# Altium schematic sheet AIL_Schem.SchDoc
size A
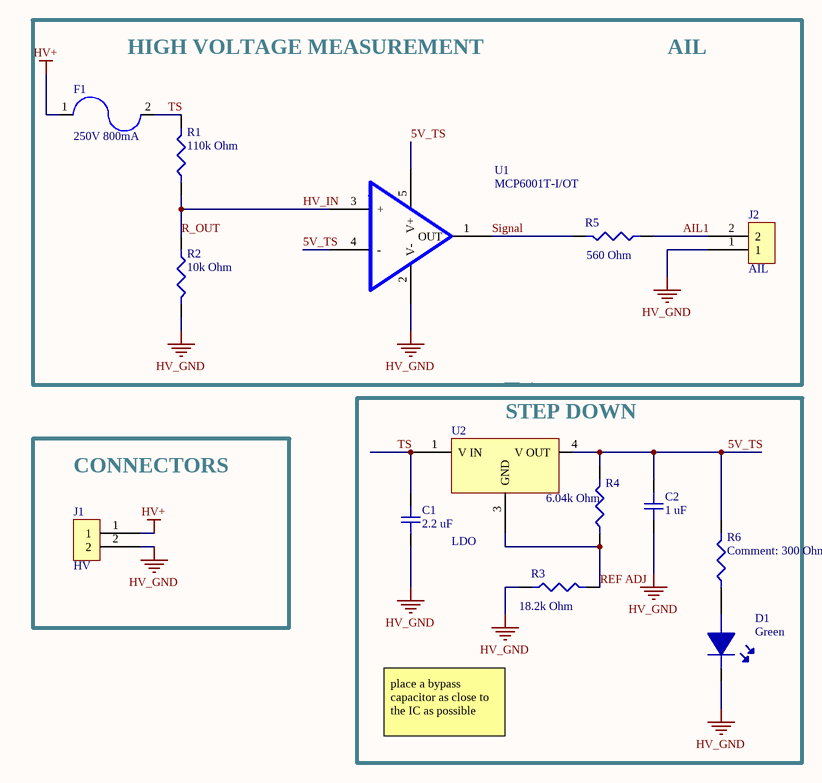
[diagram p0: AIL_Schem.SchDoc]

## Parts
C1  2.2 uF  [CAPC5850X25N]
C2  1 uF  [CAPC2012X14N]
D1  Green  [LED_0603]
F1  250V 800mA  [FUSE_SMD]
J1  HV  [2_PIN_CONNECTOR]
J2  AIL  [2_PIN_CONNECTOR]
R1  110k Ohm  [RESC3116X06N]
R2  10k Ohm  [RESC2012X06N]
R3  18.2k Ohm  [RESC2012X06N]
R4  6.04k Ohm  [RESC2012X06N]
R5  560 Ohm  [RESC2012X06N]
R6  300 Ohm  [RESC1608X06N]
U1  MCP6001T-I/OT
U2  LDO  [DPAK228P998X235-3N]

## Blocks framed on the sheet
STEP DOWN: C1 C2 D1 R3 R4 R6 U2
CONNECTORS: J1

## Nets
HV+: F1.1 J1.1
HV_GND: C1.1 C2.1 D1.2 J1.2 J2.1 R2.2 R3.1 U1.2(V-)
5V_TS: C2.2 R4.2 R6.2 U1.4(-) U1.5(V+) U2.4(V_OUT)
AIL1: J2.2 R5.1
HV_IN: R1.1 R2.1 U1.3(+)  [also labelled R_OUT]
REF ADJ: R3.2 R4.1 U2.3(GND)
Signal: R5.2 U1.1(OUT)
TS: C1.2 F1.2 R1.2 U2.1(V_IN)
NetD1_1: D1.1 R6.1

## Notes on the sheet
- HIGH VOLTAGE MEASUREMENT
- AIL
- place a bypass capacitor as close to the IC as possible

## Library data of the parts
C1 = CGA9P3X7T2E225K250KE: CAP CER 2.2UF 250V X7T 2220; Manufacturer: TDK; Tolerance: 10%; Supplier 1: Digi-Key; Manufacturer Part Number: CGA9P3X7T2E225K250KE; Stock 1: 26264; Pricing 1: 1=4.7, 10=4.227, 100=3.1935 (USD); Mount: Surface Mount; Case/Package: 2220; Weight: 0.016932oz; Case Code (Imperial): 2220; Case Code (Metric): 5750; Min Operating Temperature: -55°C; Max Operating Temperature: 125°C; Capacitance: 2.2uF; Voltage Rating (DC): 250V; Packaging: Tape and Reel; Package Quantity: 1; Voltage Rating: 250V; Dielectric: X7T; Termination: SMD/SMT; Features: Soft Termination; Length: 5.7mm; Height: 2.5mm; Width: 5mm; Thickness: 0.11inch; Depth: 5mm; Ratings: AEC-Q200; REACH SVHC: No SVHC; Lead Free: Lead Free; ComponentLink1URL: http://www.mouser.com/ds/2/400/lcc_commercial_soft_en-775842.pdf?src-supplier=Mouser; ComponentLink1Description: http://www.mouser.com/ds/2/400/lcc_commercial_soft_en-775842.pdf?src-supplier=Mouser; ComponentLink2URL: http://www.farnell.com/datasheets/1839935.pdf?src-supplier=Element14; ComponentLink2Description: http://www.farnell.com/datasheets/1839935.pdf?src-supplier=Element14; Supplier Part Number 1: 445-8766-1-ND
C2 = CL10A105KP8NNNC: Cap Ceramic 1uF 10V X5R 10% SMD 0603 85C Paper T/R; Manufacturer: Samsung; Supplier 1: Digi-Key; Manufacturer Part Number: CL10A105KP8NNNC; Stock 1: 3646234; Pricing 1: 1=0.1, 10=0.036, 100=0.0161, 500=0.01152, 1000=0.00905 (USD); Mount: Surface Mount; Case/Package: 0603; Case Code (Metric): 1608; Case Code (Imperial): 0603; Contact Plating: Tin; Min Operating Temperature: -55°C; Max Operating Temperature: 85°C; Tolerance: 10%; Packaging: Tape and Reel; Package Quantity: 1; Capacitance: 1uF; Voltage Rating: 10V; Dielectric: X5R; Voltage: 10V; Length: 1.6mm; Height: 0.8mm; Width: 0.031inch; Thickness: 0.035inch; Depth: 0.8mm; Radiation Hardening: No; ComponentLink1URL: https://www.verical.com/server-webapp/html/getDatasheet?partID=358616&src-supplier=Verical; ComponentLink1Description: https://www.verical.com/server-webapp/html/getDatasheet?partID=358616&src-supplier=Verical; ComponentLink2URL: http://www1.futureelectronics.com/doc/SAMSUNG%20PASSIVE/CL05B104KQ5NNNC.pdf?src-supplier=Future+Electronics; ComponentLink2Description: http://www1.futureelectronics.com/doc/SAMSUNG%20PASSIVE/CL05B104KQ5NNNC.pdf?src-supplier=Future+Electronics; Supplier Part Number 1: 1276-1182-1-ND
D1 = LTST-C191KGKT: LED Uni-Color Green 574nm 2-Pin Chip LED T/R; Manufacturer: Vishay Lite-On; Lens Color: Colorless; Power Rating: 75mW; Luminous Intensity: 35mcd; Viewing Angle: 130°; Lens Style: Rectangular,Colorless; Forward Current: 30mA; Forward Voltage: 2V; Dominant Wavelength: 571nm; Test Current: 20mA; Lens Transparency: Clear; Number of Elements: 1; Reverse Voltage: 5V; Supplier 1: Digi-Key; Manufacturer Part Number: LTST-C191KGKT; Stock 1: 840932; Pricing 1: 1=0.28, 10=0.201, 100=0.0954, 500=0.06364, 1000=0.04984, 2500=0.04878 (USD); Mount: Surface Mount; Case/Package: 0603; Number of Pins: 2; Color: Green; Case Code (Metric): 1608; Case Code (Imperial): 0603; Min Operating Temperature: -55°C; Max Operating Temperature: 85°C; Packaging: Tape and Reel; Package Quantity: 1; Illumination Color: Green; Power Dissipation: 75mW; Wavelength: 574nm; Number of LEDs: 1; Max Power Dissipation: 75mW; Length: 1.6mm; Height: 0.55mm; Width: 0.8mm; Depth: 0.8mm; Radiation Hardening: No; Lead Free: Lead Free; ComponentLink1URL: http://optoelectronics.liteon.com/upload/download/DS22-2000-228/LTST-C191KGKT.PDF?src-supplier=Digi-Key; ComponentLink1Description: http://optoelectronics.liteon.com/upload/download/DS22-2000-228/LTST-C191KGKT.PDF?src-supplier=Digi-Key; Supplier Part Number 1: 160-1446-1-ND
F1 = 0678D0800-02: Manufacturer: Bel; Fuse Type: Board Mount (Cartridge Style Excluded); Voltage Rating (AC): 350V; DC Cold Resistance: 380mR; Approvals: cURus; Supplier 1: Digi-Key; Manufacturer Part Number: 0678D0800-02; Stock 1: 2000; Pricing 1: 1=1.2, 5=1.164, 10=1.089, 50=0.901, 100=0.7508, 250=0.732, 500=0.61936, 1000=0.54429 (USD); Mount: Surface Mount; Case/Package: SMD/SMT; Min Operating Temperature: -55°C; Max Operating Temperature: 125°C; Packaging: Tape and Reel; Current Rating: 800mA; Voltage Rating (DC): 250V; Supplier Part Number 1: 507-2258-6-ND
J1 J2 = 0705530001: Manufacturer: Molex; Number of Positions: 2; Connector Type: Male Pin; Contact Resistance: 30mR; Pitch: 2.54mm; Supplier 1: Digi-Key; Manufacturer Part Number: 0705530001; Stock 1: 14591; Pricing 1: 1=0.71, 72=0.53486, 144=0.51264, 504=0.44575, 1008=0.36775, 5040=0.32318, 10008=0.30089 (USD); Mount: Through Hole; Color: Black; Housing Color: Black; Housing Material: Polyester; Contact Plating: Gold; Contact Material: Bronze; Min Operating Temperature: -40°C; Max Operating Temperature: 105°C; Number of Rows: 1; Packaging: Rail/Tube; Termination: Solder; Number of Contacts: 2; Orientation: Right Angle; Fastening Type: Latch; Length: 7.37mm; Depth: 13.59mm; Contact Mating Length: 0.24inch; Radiation Hardening: No; ComponentLink1URL: https://www.molex.com/pdm_docs/ps/PS-70400.pdf?src-supplier=Digi-Key; ComponentLink1Description: https://www.molex.com/pdm_docs/ps/PS-70400.pdf?src-supplier=Digi-Key; ComponentLink2URL: http://www.molex.com/webdocs/datasheets/pdf/en-us/0705530001_PCB_HEADERS.pdf?src-supplier=Avnet; ComponentLink2Description: http://www.molex.com/webdocs/datasheets/pdf/en-us/0705530001_PCB_HEADERS.pdf?src-supplier=Avnet; Supplier Part Number 1: WM4900-ND
R1 = RC1206FR-07110KL: RES SMD 110K OHM 1% 1/4W 1206; Manufacturer: Yageo; Resistance: 110kR; Power Rating: 250mW; Temperature Coefficient: 100ppm/°C; Voltage Rating (DC): 200V; Supplier 1: Digi-Key; Manufacturer Part Number: RC1206FR-07110KL; Stock 1: 78364; Pricing 1: 1=0.1, 10=0.071, 100=0.0291, 1000=0.01306, 2500=0.01134 (USD); Mount: Surface Mount; Case/Package: 1206; Case Code (Metric): 3216; Case Code (Imperial): 1206; Min Operating Temperature: -55°C; Max Operating Temperature: 155°C; Tolerance: 1%; Packaging: Tape and Reel; Package Quantity: 1; Voltage Rating: 200V; Composition: Thick Film; Number of Terminations: 2; Termination: SMD/SMT; Military Standard: Not; Max Power Dissipation: 250mW; Features: Moisture Resistant; Length: 3.1mm; Height: 0.55mm; Width: 0.063inch; Depth: 1.6mm; Lead Free: Lead Free; ComponentLink1URL: http://www.yageo.com.tw/exep/pages/download/literatures/PYu-R_INT-thick_7.pdf?src-supplier=Digi-Key; ComponentLink1Description: http://www.yageo.com.tw/exep/pages/download/literatures/PYu-R_INT-thick_7.pdf?src-supplier=Digi-Key; ComponentLink2URL: http://www.yageo.com/documents/recent/PYu-RC_Group_51_RoHS_L_9.pdf?src-supplier=Digi-Key; ComponentLink2Description: http://www.yageo.com/documents/recent/PYu-RC_Group_51_RoHS_L_9.pdf?src-supplier=Digi-Key; ComponentLink3URL: http://documents.rs-components.com/techlib://itc_doclist_GB.htm?stockno=6182344&src-supplier=RSComponents; ComponentLink3Description: http://documents.rs-components.com/techlib://itc_doclist_GB.htm?stockno=6182344&src-supplier=RSComponents; ComponentLink4URL: http://www.yageo.com/documents/recent/PYu-RC1206_51_RoHS_L-4.pdf?src-supplier=Future+Electronics; ComponentLink4Description: http://www.yageo.com/documents/recent/PYu-RC1206_51_RoHS_L-4.pdf?src-supplier=Future+Electronics; Supplier Part Number 1: 311-110KFRCT-ND
R2 = RNCP0805FTD10K0: RES 10K OHM 1% 1/4W 0805; Manufacturer: Stackpole Electronics; Resistance: 10kR; Max Power Dissipation: 250mW; Temperature Coefficient: 100ppm/°C; Supplier 1: Digi-Key; Manufacturer Part Number: RNCP0805FTD10K0; Stock 1: 152624; Pricing 1: 1=0.1, 10=0.072, 100=0.0277, 1000=0.0122, 2500=0.01053 (USD); Mount: Surface Mount; Case/Package: 0805; Case Code (Metric): 2012; Case Code (Imperial): 0805; Min Operating Temperature: -55°C; Max Operating Temperature: 155°C; Tolerance: 1%; Packaging: Tape and Reel; Composition: Thin Film; Number of Terminations: 2; Features: Moisture Resistant,Anti-Sulfur; Length: 0.079inch; Height: 0.024inch; Width: 0.049inch; Lead Free: Lead Free; ComponentLink1URL: https://www.seielect.com/catalog/SEI-Packaging.pdf?src-supplier=Digi-Key; ComponentLink1Description: https://www.seielect.com/catalog/SEI-Packaging.pdf?src-supplier=Digi-Key; Supplier Part Number 1: RNCP0805FTD10K0CT-ND
R3 = ERA-6AEB1822V: Panasonic ERA Series Thin Film Surface Mount Resistor 0805 Case 18.2k 0.1% 0.125W 25ppm/C; Resistance: 18.2kR; Power Rating: 125mW; Voltage Rating: 100V; Temperature Coefficient: 25ppm/°C; Supplier 1: Digi-Key; Manufacturer: Panasonic; Manufacturer Part Number: ERA-6AEB1822V; Stock 1: 8429; Pricing 1: 1=0.36, 10=0.302, 100=0.1182, 1000=0.04948, 2500=0.04536 (USD); Mount: Surface Mount; Case/Package: 0805; Number of Pins: 2; Case Code (Imperial): 0805; Case Code (Metric): 2012; Contact Plating: Tin; Min Operating Temperature: -55°C; Max Operating Temperature: 155°C; Tolerance: 0.1%; Packaging: Tape and Reel; Composition: Metal Film,Thin Film; Package Quantity: 5000; Number of Terminations: 2; Military Standard: Not; Termination: Solder; Max Power Dissipation: 125mW; Voltage Rating (DC): 100V; Features: Automotive AEC-Q200; Length: 2mm; Height: 0.5mm; Width: 1.25mm; Depth: 1.25mm; Radiation Hardening: No; REACH SVHC: No SVHC; Lead Free: Lead Free; ComponentLink1URL: http://www.farnell.com/datasheets/485442.pdf?src-supplier=Farnell; ComponentLink1Description: http://www.farnell.com/datasheets/485442.pdf?src-supplier=Farnell; ComponentLink2URL: http://www.mouser.com/ds/2/315/AOA0000C237-1100991.pdf?src-supplier=Mouser; ComponentLink2Description: http://www.mouser.com/ds/2/315/AOA0000C237-1100991.pdf?src-supplier=Mouser; ComponentLink3URL: http://www.farnell.com/datasheets/485442.pdf?src-supplier=Element14; ComponentLink3Description: http://www.farnell.com/datasheets/485442.pdf?src-supplier=Element14; ComponentLink4URL: http://uk.rs-online.com/webdocs/0eb1/0900766b80eb1d8c.pdf?src-supplier=RSComponents; ComponentLink4Description: http://uk.rs-online.com/webdocs/0eb1/0900766b80eb1d8c.pdf?src-supplier=RSComponents; ComponentLink5URL: https://produktinfo.conrad.com/datenblaetter/450000-474999/458878-da-01-en-WIDERSTAND_0805_ERA.pdf?src-supplier=Conrad; ComponentLink5Description: https://produktinfo.conrad.com/datenblaetter/450000-474999/458878-da-01-en-WIDERSTAND_0805_ERA.pdf?src-supplier=Conrad; Supplier Part Number 1: P18.2KDACT-ND
R4 = RR1220P-6041-D-M: RES SMD 6.04KOHM 0.5% 1/10W 0805; Manufacturer: Susumu; Resistance: 6.04kR; Power Rating: 100mW; Voltage Rating: 100V; Temperature Coefficient: 25ppm/°C; Supplier 1: Digi-Key; Manufacturer Part Number: RR1220P-6041-D-M; Stock 1: 40354; Pricing 1: 1=0.11, 10=0.098, 100=0.0376, 1000=0.01654, 2500=0.01428 (USD); Case/Package: 0805; Number of Pins: 2; Case Code (Imperial): 0805; Case Code (Metric): 2012; Min Operating Temperature: -55°C; Max Operating Temperature: 125°C; Tolerance: 0.5%; Packaging: Tape and Reel; Termination: SMD/SMT; Composition: Thin Film; Voltage Rating (DC): 100V; Length: 2mm; Height: 0.4mm; Width: 1.25mm; Lead Free: Lead Free; REACH SVHC: No SVHC; Supplier Part Number 1: RR12P6.04KDCT-ND
R5 = ESR10EZPJ561: RES SMD 560 OHM 5% 0.4W 0805; Manufacturer: Rohm; Resistance: 560R; Power Rating: 250mW; Temperature Coefficient: 200ppm/°C; Max Power Dissipation: 400mW; Supplier 1: Digi-Key; Manufacturer Part Number: ESR10EZPJ561; Stock 1: 10361; Pricing 1: 1=0.1, 10=0.083, 100=0.0318, 1000=0.01398, 2500=0.01207 (USD); Case/Package: 0805; Case Code (Metric): 2012; Case Code (Imperial): 0805; Min Operating Temperature: -55°C; Max Operating Temperature: 155°C; Tolerance: 5%; Package Quantity: 1; Packaging: Tape and Reel; Composition: Thick Film; Number of Terminations: 2; Features: Automotive AEC-Q200; Length: 0.079inch; Height: 0.026inch; Width: 0.049inch; Lead Free: Lead Free; ComponentLink1URL: http://www.rohm.com/web/global/datasheet/ESR01MZPF/esr-e?src-supplier=Digi-Key; ComponentLink1Description: http://www.rohm.com/web/global/datasheet/ESR01MZPF/esr-e?src-supplier=Digi-Key; ComponentLink2URL: https://www.rohm.com/datasheet/ESR01MZPF/esr-e?src-supplier=Digi-Key; ComponentLink2Description: https://www.rohm.com/datasheet/ESR01MZPF/esr-e?src-supplier=Digi-Key; ComponentLink3URL: http://www1.futureelectronics.com/doc/ROHM%20SEMICONDUCTOR/ESR10EZPD.pdf?src-supplier=Future+Electronics; ComponentLink3Description: http://www1.futureelectronics.com/doc/ROHM%20SEMICONDUCTOR/ESR10EZPD.pdf?src-supplier=Future+Electronics; Supplier Part Number 1: RHM560KDKR-ND
R6 = RR0816P-301-D: RES SMD 300 OHM 0.5% 1/16W 0603; Manufacturer: Susumu; Resistance: 300R; Power Rating: 63mW; Voltage Rating: 75V; Temperature Coefficient: 25ppm/°C; Supplier 1: Digi-Key; Manufacturer Part Number: RR0816P-301-D; Stock 1: 26864; Pricing 1: 1=0.11, 10=0.098, 100=0.0376, 1000=0.01654, 2500=0.01428 (USD); Case/Package: 0603; Number of Pins: 2; Case Code (Imperial): 0603; Case Code (Metric): 1608; Min Operating Temperature: -55°C; Max Operating Temperature: 125°C; Packaging: Tape and Reel; Tolerance: 0.5%; Package Quantity: 5000; Termination: SMD/SMT; Composition: Thin Film; Number of Terminations: 2; Max Power Dissipation: 63mW; Voltage Rating (DC): 75V; Length: 1.6mm; Height: 0.4mm; Width: 0.8mm; Depth: 0.8mm; REACH SVHC: Unknown; Lead Free: Lead Free; ComponentLink1URL: http://www.susumu.co.jp/common/pdf/n_catalog_partition05_en.pdf?src-supplier=Digi-Key; ComponentLink1Description: http://www.susumu.co.jp/common/pdf/n_catalog_partition05_en.pdf?src-supplier=Digi-Key; Supplier Part Number 1: RR08P300DCT-ND
U1 = MCP6001T-I/OT: MICROCHIP - MCP6001T-I/OT - OP AMP, 1MHZ, 0.6V/uS, SOT-23-5, FULL REEL; Operating Supply Voltage: 5.5V; Voltage Gain: 112dB; Min Supply Voltage: 1.8V; Max Supply Voltage: 6V; Slew Rate: 0.6V/µs; Common Mode Rejection Ratio: 60dB; Nominal Supply Current: 100uA; Number of Channels: 1; Output Current: 23mA; Input Bias Current: 1pA; Input Offset Voltage (Vos): 4.5mV; Power Supply Rejection Ratio (PSRR): 86dB; Supplier 1: Digi-Key; Manufacturer: Microchip; Manufacturer Part Number: MCP6001T-I/OT; Stock 1: 10725; Pricing 1: 1=0.24, 25=0.2, 100=0.18 (USD); Mount: Surface Mount; Case/Package: SOT-23; Number of Pins: 5; Contact Plating: Tin,Matte; Min Operating Temperature: -40°C; Max Operating Temperature: 85°C; Packaging: Tape and Reel; Bandwidth: 1MHz; Unity Gain Bandwidth Product: 1MHz; Package Quantity: 1; Number of Circuits: 1; Gain Bandwidth Product: 1MHz; Operating Supply Current: 100uA; Output Current per Channel: 23mA; Number of Elements: 1; Number of Amplifiers: 1; Voltage: 6V; Length: 3.1mm; Height: 1.3mm; Width: 1.8mm; Radiation Hardening: No; REACH SVHC: No SVHC; Lead Free: Lead Free; ComponentLink1URL: http://www.microchip.com/mymicrochip/filehandler.aspx?ddocname=en011705&src-supplier=Digi-Key; ComponentLink1Description: http://www.microchip.com/mymicrochip/filehandler.aspx?ddocname=en011705&src-supplier=Digi-Key; ComponentLink2URL: http://www.microchip.com/mymicrochip/filehandler.aspx?ddocname=en011705&src-supplier=Future+Electronics; ComponentLink2Description: http://www.microchip.com/mymicrochip/filehandler.aspx?ddocname=en011705&src-supplier=Future+Electronics; ComponentLink3URL: http://ww1.microchip.com/downloads/jp/DeviceDoc/jp011705.pdf?src-supplier=Avnet+Europe; ComponentLink3Description: http://ww1.microchip.com/downloads/jp/DeviceDoc/jp011705.pdf?src-supplier=Avnet+Europe; ComponentLink4URL: http://www.farnell.com/datasheets/524878.pdf?src-supplier=Element14; ComponentLink4Description: http://www.farnell.com/datasheets/524878.pdf?src-supplier=Element14; ComponentLink5URL: https://www.alliedelec.com/m/d/c27bf9404cef821af6de3a00b37c1e53.pdf?src-supplier=Allied+Electronics; ComponentLink5Description: https://www.alliedelec.com/m/d/c27bf9404cef821af6de3a00b37c1e53.pdf?src-supplier=Allied+Electronics; ComponentLink6URL: https://www.distrelec.biz/Web/Downloads/_t/ds/mcp6001_2_4_eng_tds.pdf?mime=application%2Fpdf&src-supplier=Distrelec; ComponentLink6Description: https://www.distrelec.biz/Web/Downloads/_t/ds/mcp6001_2_4_eng_tds.pdf?mime=application%2Fpdf&src-supplier=Distrelec; ComponentLink7URL: http://www.produktinfo.conrad.com/datenblaetter/650000-674999/651487-da-01-en-IC_OPAMP_MCP6001T_I_OT_SOT_23_5_MCP.pdf?src-supplier=Conrad; ComponentLink7Description: http://www.produktinfo.conrad.com/datenblaetter/650000-674999/651487-da-01-en-IC_OPAMP_MCP6001T_I_OT_SOT_23_5_MCP.pdf?src-supplier=Conrad; Supplier Part Number 1: MCP6001T-I/OTCT-ND
U2 = LR8K4-G: Standard Regulator Pos 1.2V to 440V 0.01A 3-Pin(2+Tab) TO-252; Manufacturer: Microchip; Max Power Dissipation: 2.5W; Max Input Voltage: 450V; Min Input Voltage: 13.2V; Number of Outputs: 1; Polarity: Positive; Output Current: 20mA; Accuracy: 5%; Power Supply Rejection Ratio (PSRR): 60dB; Output Type: Adjustable; Max Output Current: 10mA; Min Current Limit: 30mA; Dropout Voltage: 450mV; Supplier 1: Digi-Key; Manufacturer Part Number: LR8K4-G; Stock 1: 11899; Pricing 1: 1=0.93, 25=0.78, 100=0.71 (USD); Mount: Surface Mount; Case/Package: TO-252-3; Number of Pins: 3; Contact Plating: Tin,Matte; Min Operating Temperature: -40°C; Max Operating Temperature: 85°C; Output Voltage: 440V; Packaging: Cut Tape; Package Quantity: 2000; Number of Regulators: 1; Min Output Voltage: 1.2V; Max Output Voltage: 440V; Length: 6.73mm; Height: 2.39mm; Width: 6.1mm; Radiation Hardening: No; REACH SVHC: No SVHC; Lead Free: Lead Free; ComponentLink1URL: http://www.farnell.com/datasheets/1849628.pdf?src-supplier=Element14; ComponentLink1Description: http://www.farnell.com/datasheets/1849628.pdf?src-supplier=Element14; Supplier Part Number 1: LR8K4-GCT-ND